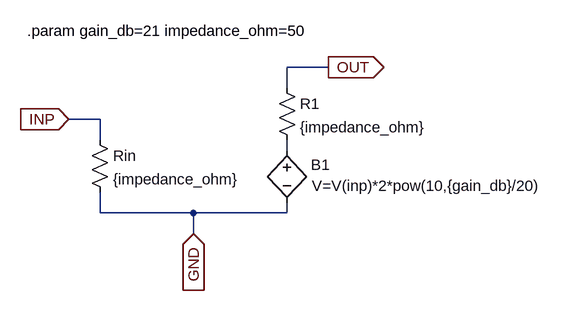
[diagram p0: schematic HMC589AST89E.asc]
HMC589AST89E.asc, the LTspice schematic file:
Version 4
SHEET 1 956 680
WIRE 240 16 176 16
WIRE 176 48 176 16
WIRE -112 96 -160 96
WIRE -112 128 -112 96
WIRE 176 144 176 128
WIRE -112 240 -112 208
WIRE 32 240 -112 240
WIRE 176 240 176 224
WIRE 176 240 32 240
WIRE 32 272 32 240
FLAG -160 96 INP
IOPIN -160 96 In
FLAG 32 272 GND
IOPIN 32 272 In
FLAG 240 16 OUT
IOPIN 240 16 Out
SYMBOL res -128 112 R0
SYMATTR InstName Rin
SYMATTR Value {impedance_ohm}
SYMBOL bv 176 128 R0
WINDOW 0 37 38 Left 2
WINDOW 3 38 70 Left 2
SYMATTR InstName B1
SYMATTR Value V=V(inp)*2*pow(10,{gain_db}/20)
SYMBOL res 160 32 R0
SYMATTR InstName R1
SYMATTR Value {impedance_ohm}
TEXT -224 -40 Left 2 !.param gain_db=21 impedance_ohm=50

The netlist it stands for:
* HMC589AST89E.asc
Rin INP GND {impedance_ohm}
B1 N001 GND V=V(inp)*2*pow(10,{gain_db}/20)
R1 OUT N001 {impedance_ohm}
.param gain_db=21 impedance_ohm=50
.backanno
.end